# Altium schematic sheet Esquema_Principal.SchDoc
size A4
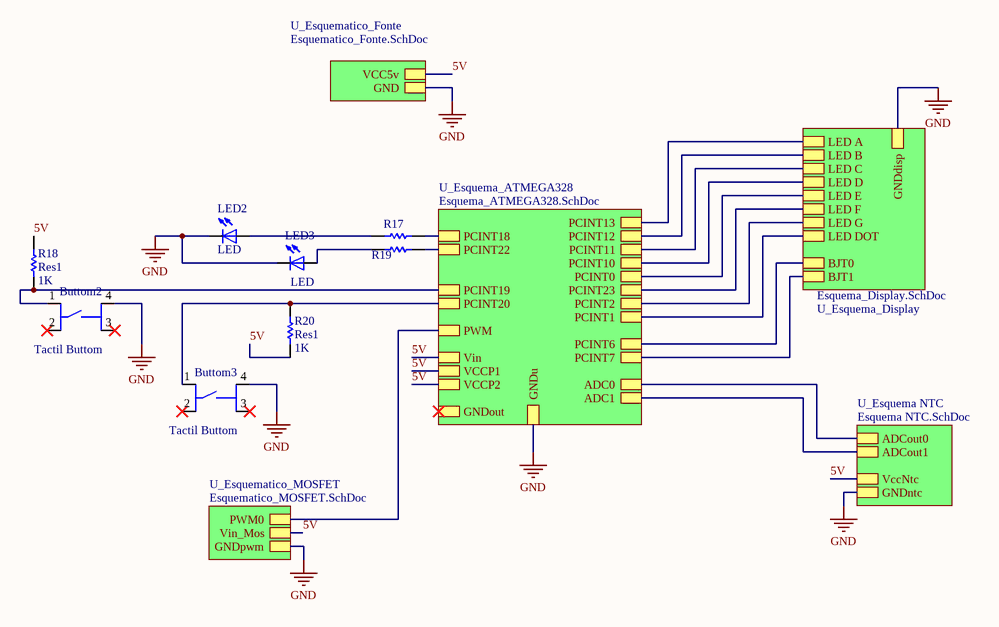
[diagram p0: Esquema_Principal.SchDoc]

## Parts
Buttom2  Tactil Buttom  [Tactil Buttom]
Buttom3  Tactil Buttom  [Tactil Buttom]
LED2  LED  [Led_THT]
LED3  LED  [Led_THT]
R17  Res1  [AXIAL-0.3]  (value not drawn)
R18  Res1  value 1K  [AXIAL-0.3]
R19  Res1  [AXIAL-0.3]  (value not drawn)
R20  Res1  value 1K  [AXIAL-0.3]

## Sub-sheets
U_Esquema NTC = Esquema NTC.SchDoc: ADCout0, ADCout1, GNDntc, VccNtc
U_Esquema_ATMEGA328 = Esquema_ATMEGA328.SchDoc: Vin, PCINT18, PCINT19, PCINT6, PCINT7, PWM, PCINT22, PCINT23, PCINT0, PCINT13, PCINT12, PCINT11, PCINT10, ADC1, ADC0, GNDout, PCINT2, PCINT1, PCINT20, VCCP1, VCCP2, GNDu
U_Esquema_Display = Esquema_Display.SchDoc: BJT0, BJT1, LED A, LED B, LED C, LED D, LED E, LED F, LED G, LED DOT, GNDdisp
U_Esquematico_Fonte = Esquematico_Fonte.SchDoc: VCC5v, GND
U_Esquematico_MOSFET = Esquematico_MOSFET.SchDoc: PWM0, Vin_Mos, GNDpwm

## Nets
GND: Buttom2.4 Buttom3.4 LED2.K(C) LED3.K(C) ; sheet U_Esquema_ATMEGA328/GNDu, sheet U_Esquema_Display/GNDdisp, sheet U_Esquematico_Fonte/GND, sheet U_Esquema NTC/GNDntc, sheet U_Esquematico_MOSFET/GNDpwm
5V: R18.2 R20.1 ; sheet U_Esquema_ATMEGA328/Vin, sheet U_Esquema_ATMEGA328/VCCP1, sheet U_Esquema_ATMEGA328/VCCP2, sheet U_Esquematico_Fonte/VCC5v, sheet U_Esquema NTC/VccNtc, sheet U_Esquematico_MOSFET/Vin_Mos
NetButtom2_1: Buttom2.1 R18.1 ; sheet U_Esquema_ATMEGA328/PCINT19
NetButtom3_1: Buttom3.1 R20.2 ; sheet U_Esquema_ATMEGA328/PCINT20
NetLED2_A: LED2.A R17.1
NetLED3_A: LED3.A R19.1
NetR17_2: R17.2 ; sheet U_Esquema_ATMEGA328/PCINT18
NetR19_2: R19.2 ; sheet U_Esquema_ATMEGA328/PCINT22
(unnamed): sheet U_Esquema_ATMEGA328/PCINT6, sheet U_Esquema_Display/BJT0
(unnamed): sheet U_Esquema_ATMEGA328/PCINT7, sheet U_Esquema_Display/BJT1
(unnamed): sheet U_Esquema_ATMEGA328/PWM, sheet U_Esquematico_MOSFET/PWM0
(unnamed): sheet U_Esquema_ATMEGA328/PCINT23, sheet U_Esquema_Display/LED F
(unnamed): sheet U_Esquema_ATMEGA328/PCINT0, sheet U_Esquema_Display/LED E
(unnamed): sheet U_Esquema_ATMEGA328/PCINT13, sheet U_Esquema_Display/LED A
(unnamed): sheet U_Esquema_ATMEGA328/PCINT12, sheet U_Esquema_Display/LED B
(unnamed): sheet U_Esquema_ATMEGA328/PCINT11, sheet U_Esquema_Display/LED C
(unnamed): sheet U_Esquema_ATMEGA328/PCINT10, sheet U_Esquema_Display/LED D
(unnamed): sheet U_Esquema_ATMEGA328/ADC1, sheet U_Esquema NTC/ADCout1
(unnamed): sheet U_Esquema_ATMEGA328/ADC0, sheet U_Esquema NTC/ADCout0
(unnamed): sheet U_Esquema_ATMEGA328/PCINT2, sheet U_Esquema_Display/LED G
(unnamed): sheet U_Esquema_ATMEGA328/PCINT1, sheet U_Esquema_Display/LED DOT

Not connected (* = marked no-connect by the designer): Buttom2 2* 3*; Buttom3 2* 3*

## Library data of the parts
R17 R19 = Res1: Resistor; Value: 1K; Published: 8-Jun-2000; LatestRevisionDate: 17-Jul-2002; LatestRevisionNote: Re-released for DXP Platform.; PackageReference: AXIAL-0.3; Publisher: Altium Limited; PackageDescription: Axial Device, Thru-Hole; 2 Leads; 0.3 in Pin Spacing
R18 R20 = Res1: Resistor; Published: 8-Jun-2000; LatestRevisionDate: 17-Jul-2002; LatestRevisionNote: Re-released for DXP Platform.; PackageReference: AXIAL-0.3; Publisher: Altium Limited; PackageDescription: Axial Device, Thru-Hole; 2 Leads; 0.3 in Pin Spacing